# EAGLE schematic ToneGeneratorSMD_V1viii (EAGLE 9.3.2)
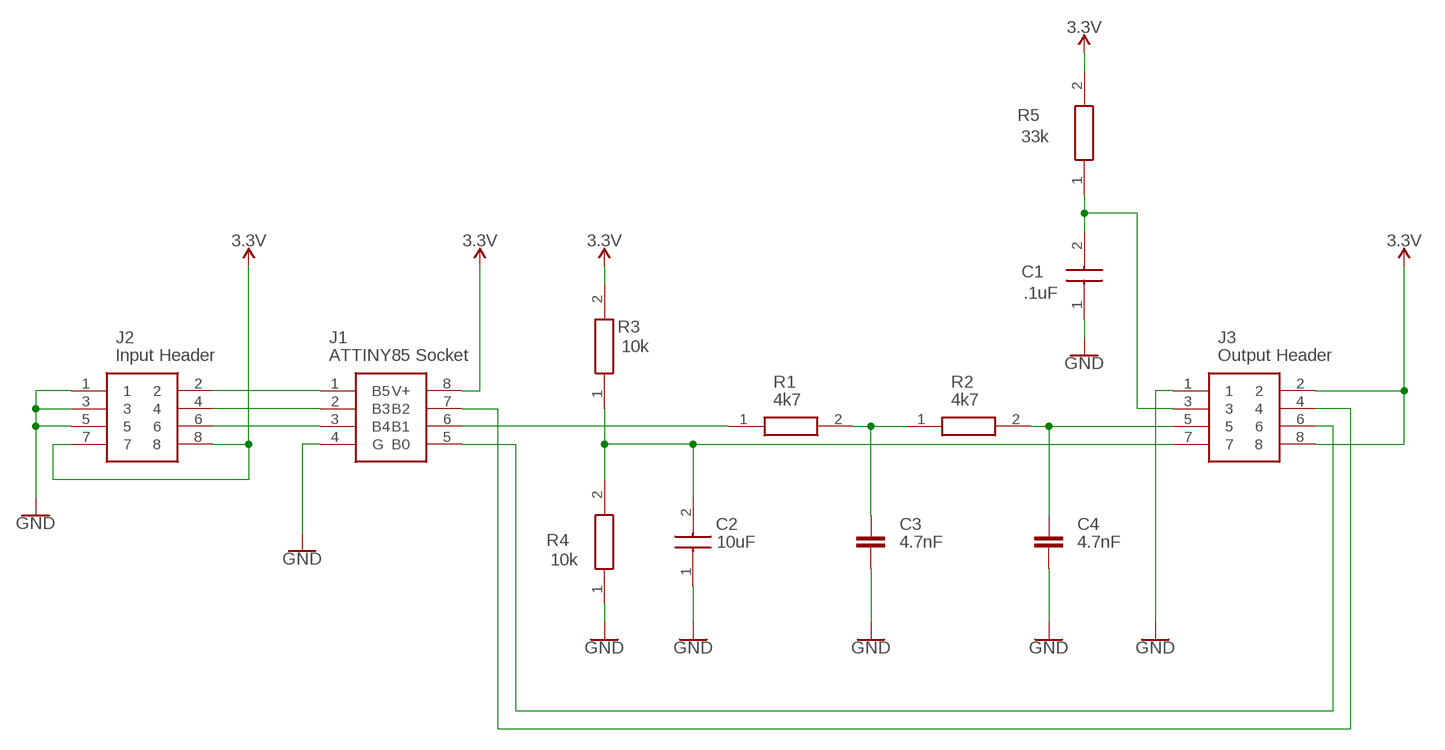
[diagram p0: schematic, sheet 1]

## Parts
C1  .1uF  885012207098  [CAPC2012X90N]
C2  10uF  GRM21BR61E106MA73L  [CAPC2012X145N]
C3  4.7nF  C-EUC0805  [C0805]
C4  4.7nF  C-EUC0805  [C0805]
J1  ATTINY85 Socket  214-44-308-01-670800  [2144430801670800]
J2  Input Header  87898-0826  [878980826]
J3  Output Header  87898-0826  [878980826]
R1  4k7  ERJ-6GEYJ472V  [RESC2013X65N]
R2  4k7  ERJ-6GEYJ472V  [RESC2013X65N]
R3  10k  ERJ-6GEYJ472V  [RESC2013X65N]
R4  10k  ERJ-6GEYJ472V  [RESC2013X65N]
R5  33k  ERJ-6GEYJ472V  [RESC2013X65N]

## Nets
3.3V: J1.8(V+) J2.7 J2.8 J3.2 J3.8 R3.2(R2) R5.2(R2)
GND: C1.1 C2.1 C3.2 C4.2 J1.4(G) J2.1 J2.3 J2.5 J3.1 R4.1(R1)
N$1: C2.2 J3.7 R3.1(R1) R4.2(R2)
N$2: C3.1 R1.2(R2) R2.1(R1)
N$3: C4.1 J3.5 R2.2(R2)
N$4: C1.2 J3.3 R5.1(R1)
N$5: J1.6(B1) R1.1(R1)
N$6: J1.5(B0) J3.6
N$7: J1.1(B5) J2.2
N$8: J1.7(B2) J3.4
N$9: J1.2(B3) J2.4
N$10: J1.3(B4) J2.6

## Library data of the parts
C1 = ToneGenerator_Parts:885012207098: Multilayer Ceramic Capacitors MLCC - SMD/SMT WCAP-CSGP 0.1uF 0805 10% 50V MLCC Source: Datasheet <https://componentsearchengine.com/Datasheets/1/885012207098.pdf>; DESCRIPTION: Multilayer Ceramic Capacitors MLCC - SMD/SMT WCAP-CSGP 0.1uF 0805 10% 50V MLCC; HEIGHT: 0.9mm; MANUFACTURER_NAME: Wurth Elektronik; MANUFACTURER_PART_NUMBER: 885012207098; MOUSER_PART_NUMBER: 710-885012207098; MOUSER_PRICE-STOCK: https://www.mouser.com/Search/Refine.aspx?Keyword=710-885012207098
C2 = ToneGenerator_Parts:GRM21BR61E106MA73L: Multilayer Ceramic Capacitors MLCC - SMD/SMT 0805 10uF 25volts X5R 20% Source: Datasheet <https://componentsearchengine.com/Datasheets/1/GRM21BR61E106MA73L.pdf>; DESCRIPTION: Multilayer Ceramic Capacitors MLCC - SMD/SMT 0805 10uF 25volts X5R 20%; HEIGHT: 1.45mm; MANUFACTURER_NAME: Murata Electronics; MANUFACTURER_PART_NUMBER: GRM21BR61E106MA73L; MOUSER_PART_NUMBER: 81-GRM21BR61E106MA3L; MOUSER_PRICE-STOCK: https://www.mouser.com/Search/Refine.aspx?Keyword=81-GRM21BR61E106MA3L
C3 C4 = rcl:C-EU: CAPACITOR, European symbol; SPICEPREFIX: C
J1 = ToneGenerator_Parts:214-44-308-01-670800: MILL MAX - 214-44-308-01-670800 - SOCKET, DIL, 8 WAY, 0.3MM Source: Datasheet <https://www.mill-max.com/assets/pdfs/108.pdf>; DESCRIPTION: MILL MAX - 214-44-308-01-670800 - SOCKET, DIL, 8 WAY, 0.3MM; HEIGHT: 4.2164mm; MANUFACTURER_NAME: Mill-Max; MANUFACTURER_PART_NUMBER: 214-44-308-01-670800; MOUSER_PART_NUMBER: 575-4430801; MOUSER_PRICE-STOCK: https://www.mouser.com/Search/Refine.aspx?Keyword=575-4430801
J2 J3 = ToneGenerator_Parts:87898-0826: Headers & Wire Housings 2.54mm SRSW SMT Hd r W/O Cap 2.5SnLF 8P Source: Datasheet <https://componentsearchengine.com/Datasheets/1/87898-0826.pdf>; DESCRIPTION: Headers & Wire Housings 2.54mm SRSW SMT Hd r W/O Cap 2.5SnLF 8P; HEIGHT: 10.81mm; MANUFACTURER_NAME: Molex; MANUFACTURER_PART_NUMBER: 87898-0826; MOUSER_PART_NUMBER: 538-87898-0826
R1-R5 = SamacSys_Parts:ERJ-6GEYJ472V: RESISTOR, 0805 4.7K Ohm +/-5% 0.125 W Source: Datasheet <https://componentsearchengine.com/Datasheets/1/ERJ-6GEYJ472V.pdf>; DESCRIPTION: RESISTOR, 0805 4.7K Ohm +/-5% 0.125 W; HEIGHT: mm; MANUFACTURER_NAME: Panasonic; MANUFACTURER_PART_NUMBER: ERJ-6GEYJ472V; MOUSER_PART_NUMBER: 667-ERJ-6GEYJ472V; MOUSER_PRICE-STOCK: https://www.mouser.com/Search/Refine.aspx?Keyword=667-ERJ-6GEYJ472V